# EAGLE schematic wifirot (EAGLE 7.5.0)
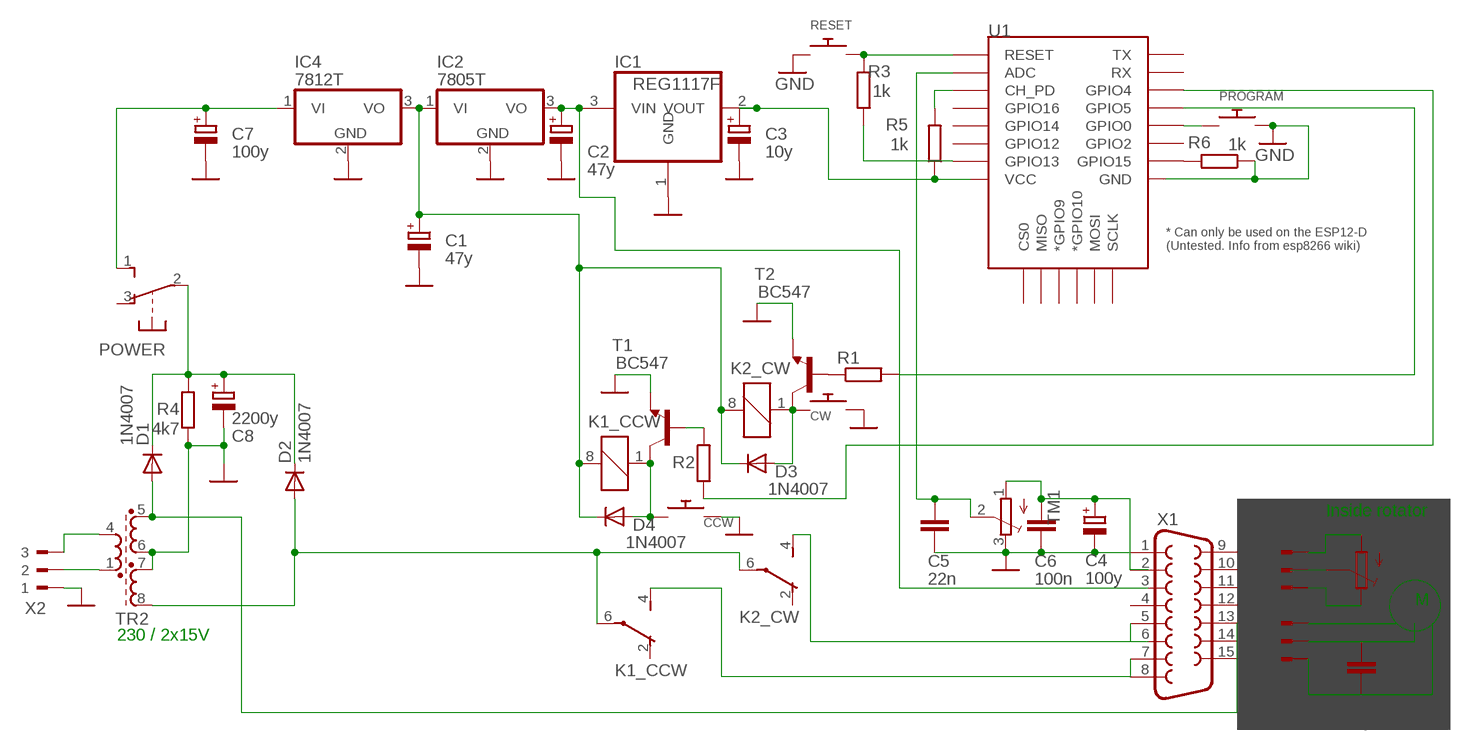
[diagram p0: schematic, sheet 1]

## Parts
C1  47y  CPOL-EUE2-4  [E2-4]
C2  47y  CPOL-EUE2-4  [E2-4]
C3  10y  CPOL-EUE2-4  [E2-4]
C4  100y  CPOL-EUE2-4  [E2-4]
C5  22n  C5/2.5  [C5B2.5]
C6  100n  C5/2.5  [C5B2.5]
C7  100y  CPOL-EUE2-4  [E2-4]
C8  2200y  CPOL-EUE2-4  [E2-4]
C9  4y  C5/2.5  [C5B2.5]
CCW  SWITCH_PUSHBUTTONC&K_KSS  [BTN_CK_KSS]
CW  SWITCH_PUSHBUTTONC&K_KSS  [BTN_CK_KSS]
D1  1N4007  DIODE-D-2.5  [D-2.5]
D2  1N4007  DIODE-D-2.5  [D-2.5]
D3  1N4007  DIODE-D-2.5  [D-2.5]
D4  1N4007  DIODE-D-2.5  [D-2.5]
IC1  REG1117F  [DD-3]
IC2  7805T  [TO220H]
IC4  7812T  [TO220H]
K1_CCW  JW1C  [JW1C]
K2_CW  JW1C  [JW1C]
POWER  9077-1  [9077-1]
PROGRAM  SWITCH_PUSHBUTTONC&K_KSS  [BTN_CK_KSS]
R1  R-EU_0207/15  [0207/15]
R2  R-EU_0207/15  [0207/15]
R3  1k  R-EU_0207/15  [0207/15]
R4  4k7  R-EU_0207/15  [0207/15]
R5  1k  R-EU_0207/15  [0207/15]
R6  1k  R-EU_0207/15  [0207/15]
RESET  SWITCH_PUSHBUTTONC&K_KSS  [BTN_CK_KSS]
T1  BC547  [TO92]
T2  BC547  [TO92]
TM1  TRIMPOTTC33X  [TC33X]
TM2  5k 5turn  TRIMPOTTC33X  [TC33X]
TR2  SMR6-3W  [SM-R6]
U1  ESP12ESMD  [ESP12E-SMD]
X1  F15V  [F15V]
X2  90-3  [90-3]
X3  90-3  [90-3]
X4  90-3  [90-3]

## Nets
GND: C1.- C2.- C3.- C4.- C5.2 C6.2 C7.- C8.- CCW.P$2 CW.P$2 IC1.1(GND) IC2.2(GND) IC4.2(GND) PROGRAM.P$2 R4.1 R6.1 RESET.P$1 T1.1(E) T2.1(E) TM1.3(E) TR2.6 TR2.7 X1.1 X2.1
N$1: C2.+ IC1.3(VIN) IC2.3(VO)
N$2: C1.+ D3.C D4.C IC2.1(VI) IC4.3(VO) K1_CCW.8 K2_CW.8
N$3: CCW.P$1 D4.A K1_CCW.1 T1.3(C)
N$4: CW.P$1 D3.A K2_CW.1 T2.3(C)
N$5: R3.2 RESET.P$2 U1.RESET
N$6: R1.1 T2.2(B)
N$7: R2.2 T1.2(B)
N$8: C3.+ IC1.2(VOUT) R5.1
N$9: R2.1 U1.GPIO4
N$10: R1.2 U1.GPIO5
N$11: R3.1 U1.GPIO13
N$12: TM2.1(A) X3.3
N$13: C4.+ C6.1 TM1.1(A) X1.2
N$14: C5.1 TM1.2(S) U1.ADC
N$15: K2_CW.4(1:S) X1.5
N$16: K1_CCW.4(1:S) X1.7 X1.8
N$17: TM2.2(S)
N$18: D2.A K1_CCW.6(1:P) K2_CW.6(1:P) TR2.8
N$19: C8.+ D1.C D2.C POWER.2(P) R4.2
N$20: PROGRAM.P$1 U1.GPIO0
N$21: C7.+ IC4.1(VI) POWER.1(S)
N$22: R5.2 U1.CH_PD
N$23: R6.2 U1.GPIO15
N$24: D1.A TR2.5 X1.13 X1.14 X1.15
N$25: TM2.3(E) X3.1
N$26: TR2.4 X2.3
N$27: TR2.1 X2.2
N$28: X4.3
N$29: C9.1 X4.2
N$30: C9.2 X4.1
Unconnected: K1_CCW.2(1:O) K2_CW.2(1:O) POWER.3(O) U1.CS0 U1.GND U1.GPIO2 U1.GPIO9(*GPIO9) U1.GPIO10(*GPIO10) U1.GPIO12 U1.GPIO14 U1.GPIO16 U1.MISO U1.MOSI U1.RXD0(RX) U1.SCLK U1.TXD0(TX) U1.VCC X1.3 X1.4 X1.6 X1.9 X1.10 X1.11 X1.12 X3.2

## Notes on the sheet
- Inside rotator
- M
- 230 / 2x15V

## Library data of the parts
C1-C4 C7 C8 = rcl:CPOL-EU: POLARIZED CAPACITOR, European symbol
C5 C6 C9 = capacitor-wima:C: CAPACITOR naming: grid - package width
CCW CW PROGRAM RESET = adafruit:SWITCH_PUSHBUTTON: Buttons SOFTTOUCHSMD_SJ - Soft touch temporary push button (Super Junk Akihabara) Compatible with SKPMANE010 [Mouser: 688-SKPMAN] C&K_KSS = Digikey: KSS221GLFS
D1-D4 = diode:DIODE-: DIODE
IC1 = burr-brown:REG1117: 800mA and 1A Low Dropout (LDO) Positive Regulator 1.8V, 2.5V, 2.85V, 3.3V, 5V, and Adj; MF: TEXAS INSTRUMENTS; MPN: REG1117FAKTTT; OC_FARNELL: 1296120; OC_NEWARK: 87H2562
IC2 IC4 = adafruit:78*: Positive VOLTAGE REGULATOR Added bigger pads to the TO-92 package
K1_CCW K2_CW = relay:JW1C: Power relay Source: Panasonic Electric Works Co., Ltd. / jw.catalog.pdf
POWER = switch-misc:9077-1: MARQUARDT SWITCH 9077.0100 Distributor: Buerklin <https://www.buerklin.com/default.asp?event=ShowArtikel%2812G2820%29&l=d&jump=ArtNr_12G2820>
R1-R6 = resistor:R-EU_: RESISTOR, European symbol
T1 T2 = transistor:BC547: NPN TRANSISTOR
TM1 TM2 = adafruit:TRIMPOT: SMT trimmer potentiometer part number TC33X http://www.ladyada.net/library/eagle
TR2 = inductor-neosid:SMR6-3W: TRANSFORMER SMD toroidal-core transformer with 3 windings; OC_FARNELL: unknown; OC_NEWARK: unknown
U1 = esp8266modules:ESP12E: ESP12E Module
X1 = adafruit:F15: SUB-D HDH is also known as a 'right angle VGA' connector
X2-X4 = con-weidmueller-sl35:90-3: WEIDMUELLER CLAMP CONNECTOR; OC_FARNELL: unknown; OC_NEWARK: unknown